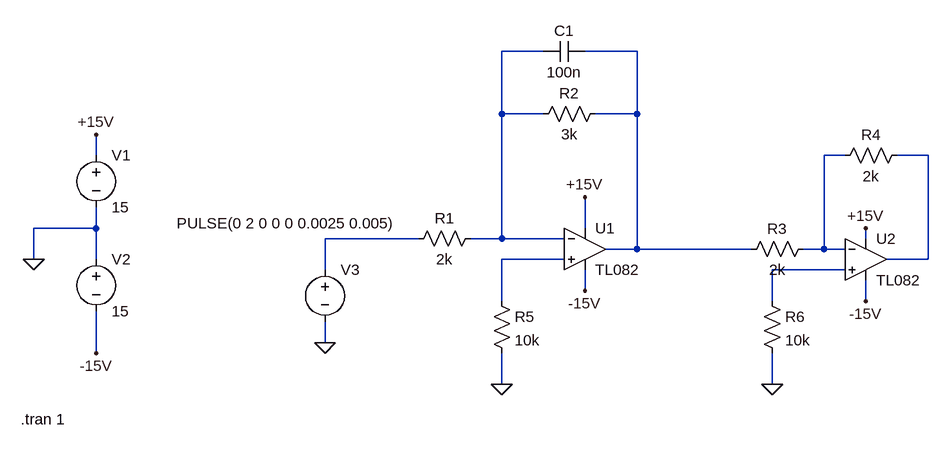
[diagram p0: schematic simulation.asc]
simulation.asc, the LTspice schematic file:
Version 4
SHEET 1 1028 680
WIRE 432 -144 368 -144
WIRE 576 -144 496 -144
WIRE 368 -48 368 -144
WIRE 432 -48 368 -48
WIRE 576 -48 576 -144
WIRE 576 -48 512 -48
WIRE -256 16 -256 -16
WIRE 896 16 864 16
WIRE 1024 16 976 16
WIRE -256 128 -256 96
WIRE -256 128 -352 128
WIRE 496 128 496 80
WIRE 240 144 96 144
WIRE 368 144 368 -48
WIRE 368 144 320 144
WIRE 464 144 368 144
WIRE 928 144 928 128
WIRE 576 160 576 -48
WIRE 576 160 528 160
WIRE 752 160 576 160
WIRE 864 160 864 16
WIRE 864 160 832 160
WIRE 896 160 864 160
WIRE -352 176 -352 128
WIRE -256 176 -256 128
WIRE 464 176 368 176
WIRE 1024 176 1024 16
WIRE 1024 176 960 176
WIRE 96 192 96 144
WIRE 896 192 784 192
WIRE 496 224 496 192
WIRE 368 240 368 176
WIRE 784 240 784 192
WIRE 928 240 928 208
WIRE 96 304 96 272
WIRE -256 320 -256 256
WIRE 368 368 368 320
WIRE 784 368 784 320
FLAG -256 -16 +15V
FLAG -256 320 -15V
FLAG -352 176 0
FLAG 496 80 +15V
FLAG 496 224 -15V
FLAG 784 368 0
FLAG 368 368 0
FLAG 928 240 -15V
FLAG 928 128 +15V
FLAG 96 304 0
SYMBOL EXTRA\\ExtraOpamps\\TL082 496 160 R0
SYMATTR InstName U1
SYMBOL EXTRA\\ExtraOpamps\\TL082 928 176 R0
SYMATTR InstName U2
SYMBOL res 848 144 R90
WINDOW 0 0 56 VBottom 2
WINDOW 3 32 56 VTop 2
SYMATTR InstName R3
SYMATTR Value 2k
SYMBOL res 768 224 R0
SYMATTR InstName R6
SYMATTR Value 10k
SYMBOL res 992 0 R90
WINDOW 0 0 56 VBottom 2
WINDOW 3 32 56 VTop 2
SYMATTR InstName R4
SYMATTR Value 2k
SYMBOL voltage -256 0 R0
WINDOW 123 0 0 Left 0
WINDOW 39 0 0 Left 0
SYMATTR InstName V1
SYMATTR Value 15
SYMBOL voltage -256 160 R0
WINDOW 123 0 0 Left 0
WINDOW 39 0 0 Left 0
SYMATTR InstName V2
SYMATTR Value 15
SYMBOL res 528 -64 R90
WINDOW 0 0 56 VBottom 2
WINDOW 3 32 56 VTop 2
SYMATTR InstName R2
SYMATTR Value 3k
SYMBOL res 352 224 R0
SYMATTR InstName R5
SYMATTR Value 10k
SYMBOL res 336 128 R90
WINDOW 0 0 56 VBottom 2
WINDOW 3 32 56 VTop 2
SYMATTR InstName R1
SYMATTR Value 2k
SYMBOL voltage 96 176 R0
WINDOW 3 -228 -56 Left 2
WINDOW 123 0 0 Left 0
WINDOW 39 0 0 Left 0
SYMATTR InstName V3
SYMATTR Value PULSE(0 2 0 0 0 0.0025 0.005)
SYMBOL cap 496 -160 R90
WINDOW 0 0 32 VBottom 2
WINDOW 3 32 32 VTop 2
SYMATTR InstName C1
SYMATTR Value 100n
TEXT -372 422 Left 2 !.tran 1

The netlist it stands for:
* simulation.asc
* U1: TL082 (symbol EXTRA\ExtraOpamps\TL082 not available, pins judged from their places): In+=N006 In-=N001 V+=+15V V-=-15V OUT=N002
* U2: TL082 (symbol EXTRA\ExtraOpamps\TL082 not available, pins judged from their places): In+=N007 In-=N003 V+=+15V V-=-15V OUT=N004
R3 N003 N002 2k
R6 N007 0 10k
R4 N004 N003 2k
V1 +15V 0 15
V2 0 -15V 15
R2 N002 N001 3k
R5 N006 0 10k
R1 N001 N005 2k
V3 N005 0 PULSE(0 2 0 0 0 0.0025 0.005)
C1 N002 N001 100n
.tran 1
.backanno
.end